# EAGLE design 15_MOV8 (EAGLE 7.5.0)
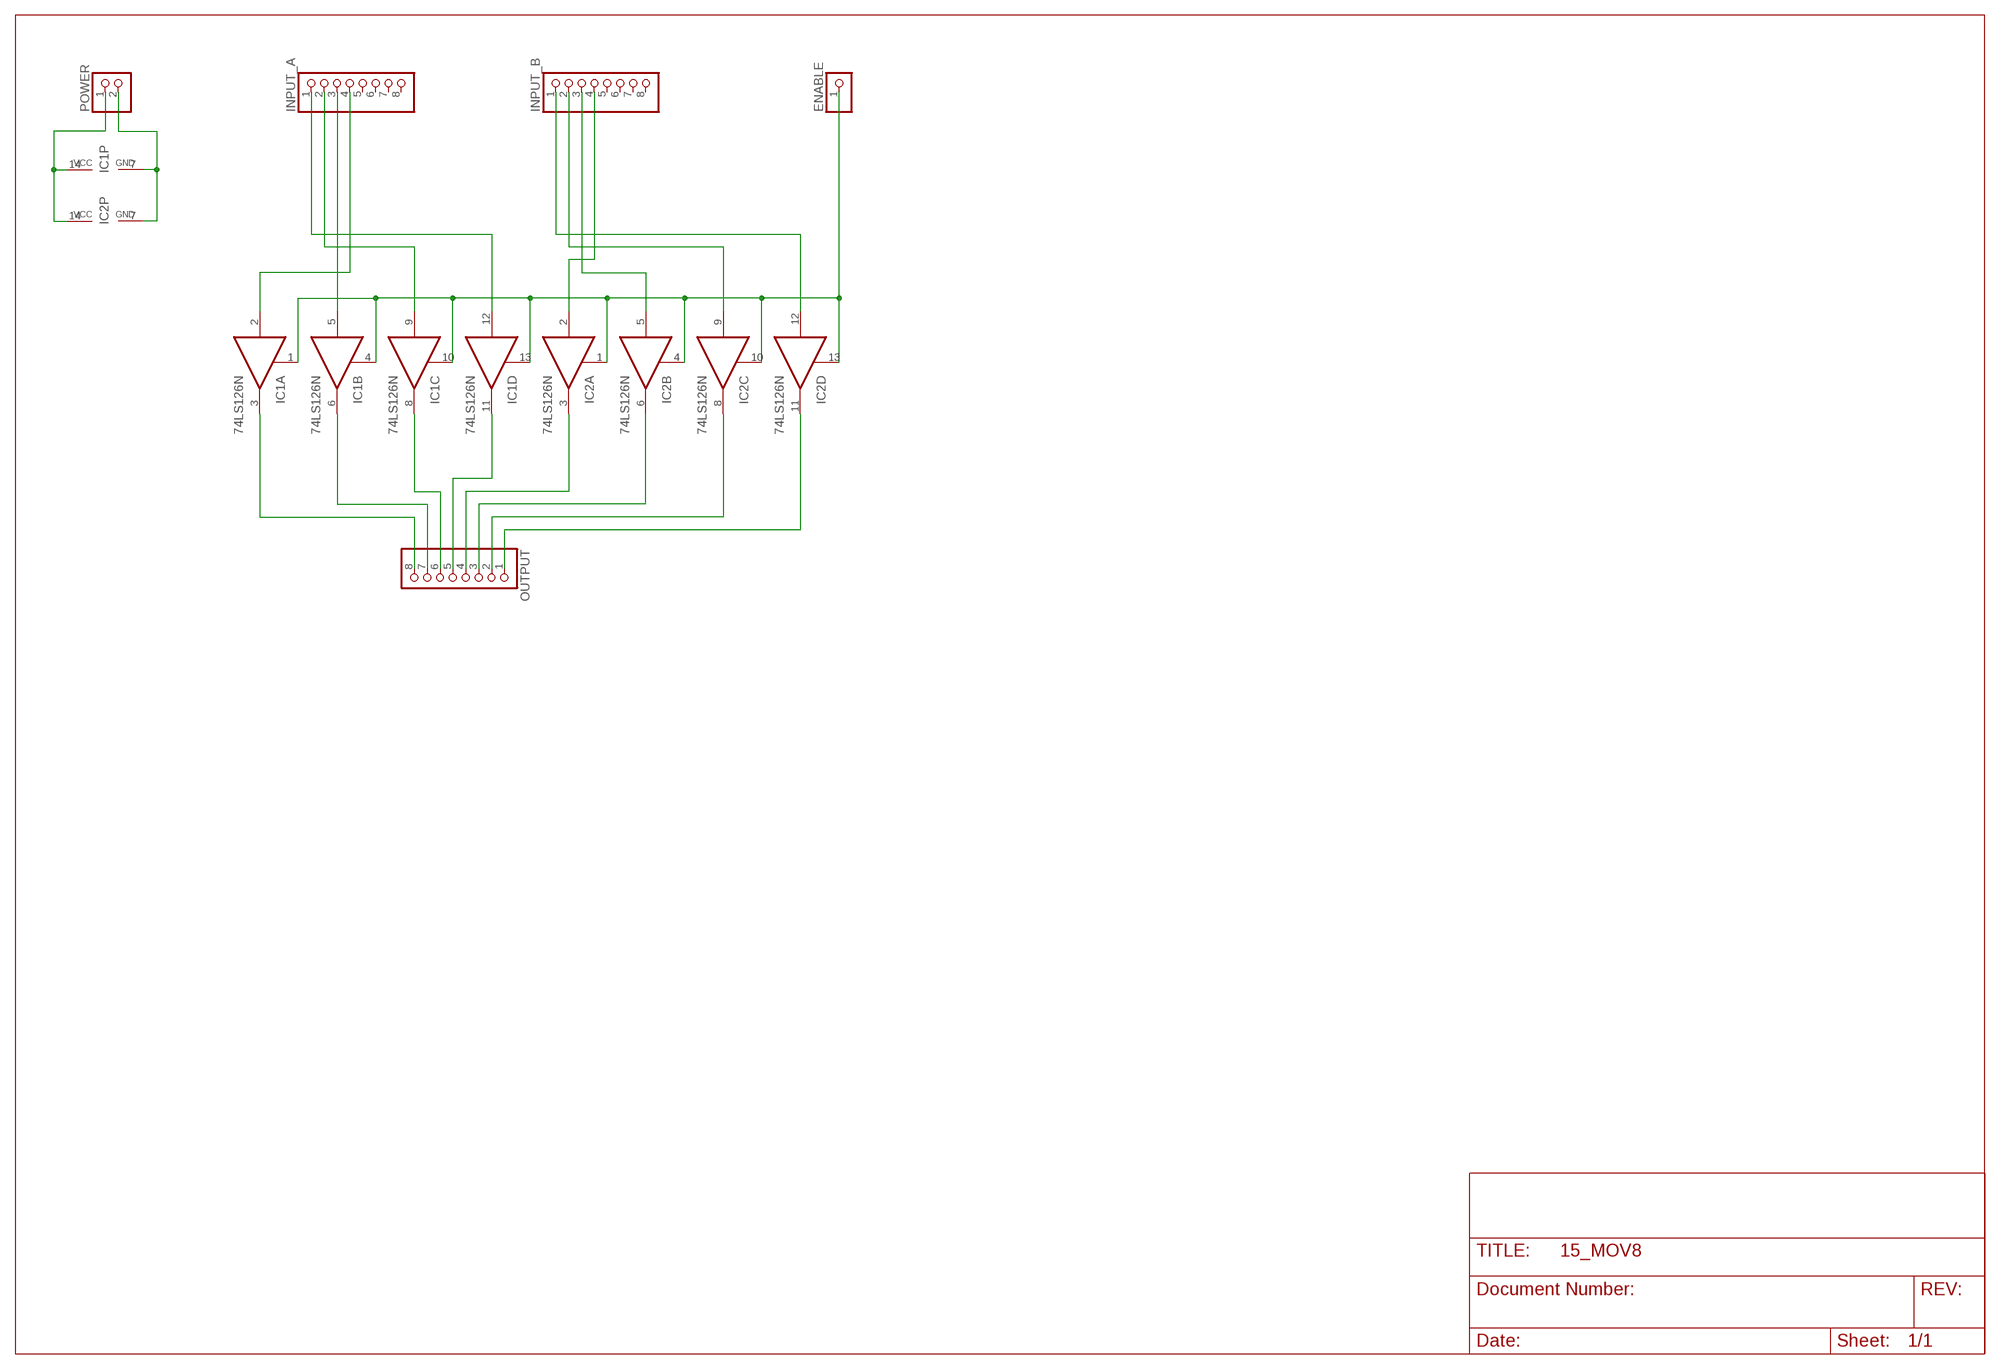
[diagram p0: schematic, sheet 1]

## Parts
ENABLE  PINHD-1X1  [1X01]
IC1  74LS126N  [DIL14]
IC2  74LS126N  [DIL14]
INPUT_A  PINHD-1X8  [1X08]
INPUT_B  PINHD-1X8  [1X08]
OUTPUT  PINHD-1X8  [1X08]
POWER  PINHD-1X2  [1X02]

## Nets
GND: IC1.7(P:GND) IC2.7(P:GND) POWER.2
N$1: IC1.3(A:O) OUTPUT.8
N$2: IC1.6(B:O) OUTPUT.7
N$3: IC1.8(C:O) OUTPUT.6
N$4: IC1.11(D:O) OUTPUT.5
N$5: IC2.3(A:O) OUTPUT.4
N$6: IC2.6(B:O) OUTPUT.3
N$7: IC2.8(C:O) OUTPUT.2
N$8: IC2.11(D:O) OUTPUT.1
N$9: IC1.12(D:I) INPUT_A.1
N$10: IC1.9(C:I) INPUT_A.2
N$11: IC1.5(B:I) INPUT_A.3
N$12: IC1.2(A:I) INPUT_A.4
N$13: IC2.12(D:I) INPUT_B.1
N$14: IC2.9(C:I) INPUT_B.2
N$15: IC2.5(B:I) INPUT_B.3
N$16: IC2.2(A:I) INPUT_B.4
N$17: ENABLE.1 IC1.1(A:OE) IC1.4(B:OE) IC1.10(C:OE) IC1.13(D:OE) IC2.1(A:OE) IC2.4(B:OE) IC2.10(C:OE) IC2.13(D:OE)
VCC: IC1.14(P:VCC) IC2.14(P:VCC) POWER.1
Unconnected: INPUT_A.5 INPUT_A.6 INPUT_A.7 INPUT_A.8 INPUT_B.5 INPUT_B.6 INPUT_B.7 INPUT_B.8

## Library data of the parts
ENABLE = pinhead:PINHD-1X1: PIN HEADER
IC1 IC2 = 74xx-eu:74*126: Quad bus BUFFER, 3-state
INPUT_A INPUT_B OUTPUT = pinhead:PINHD-1X8: PIN HEADER
POWER = pinhead:PINHD-1X2: PIN HEADER

## Board
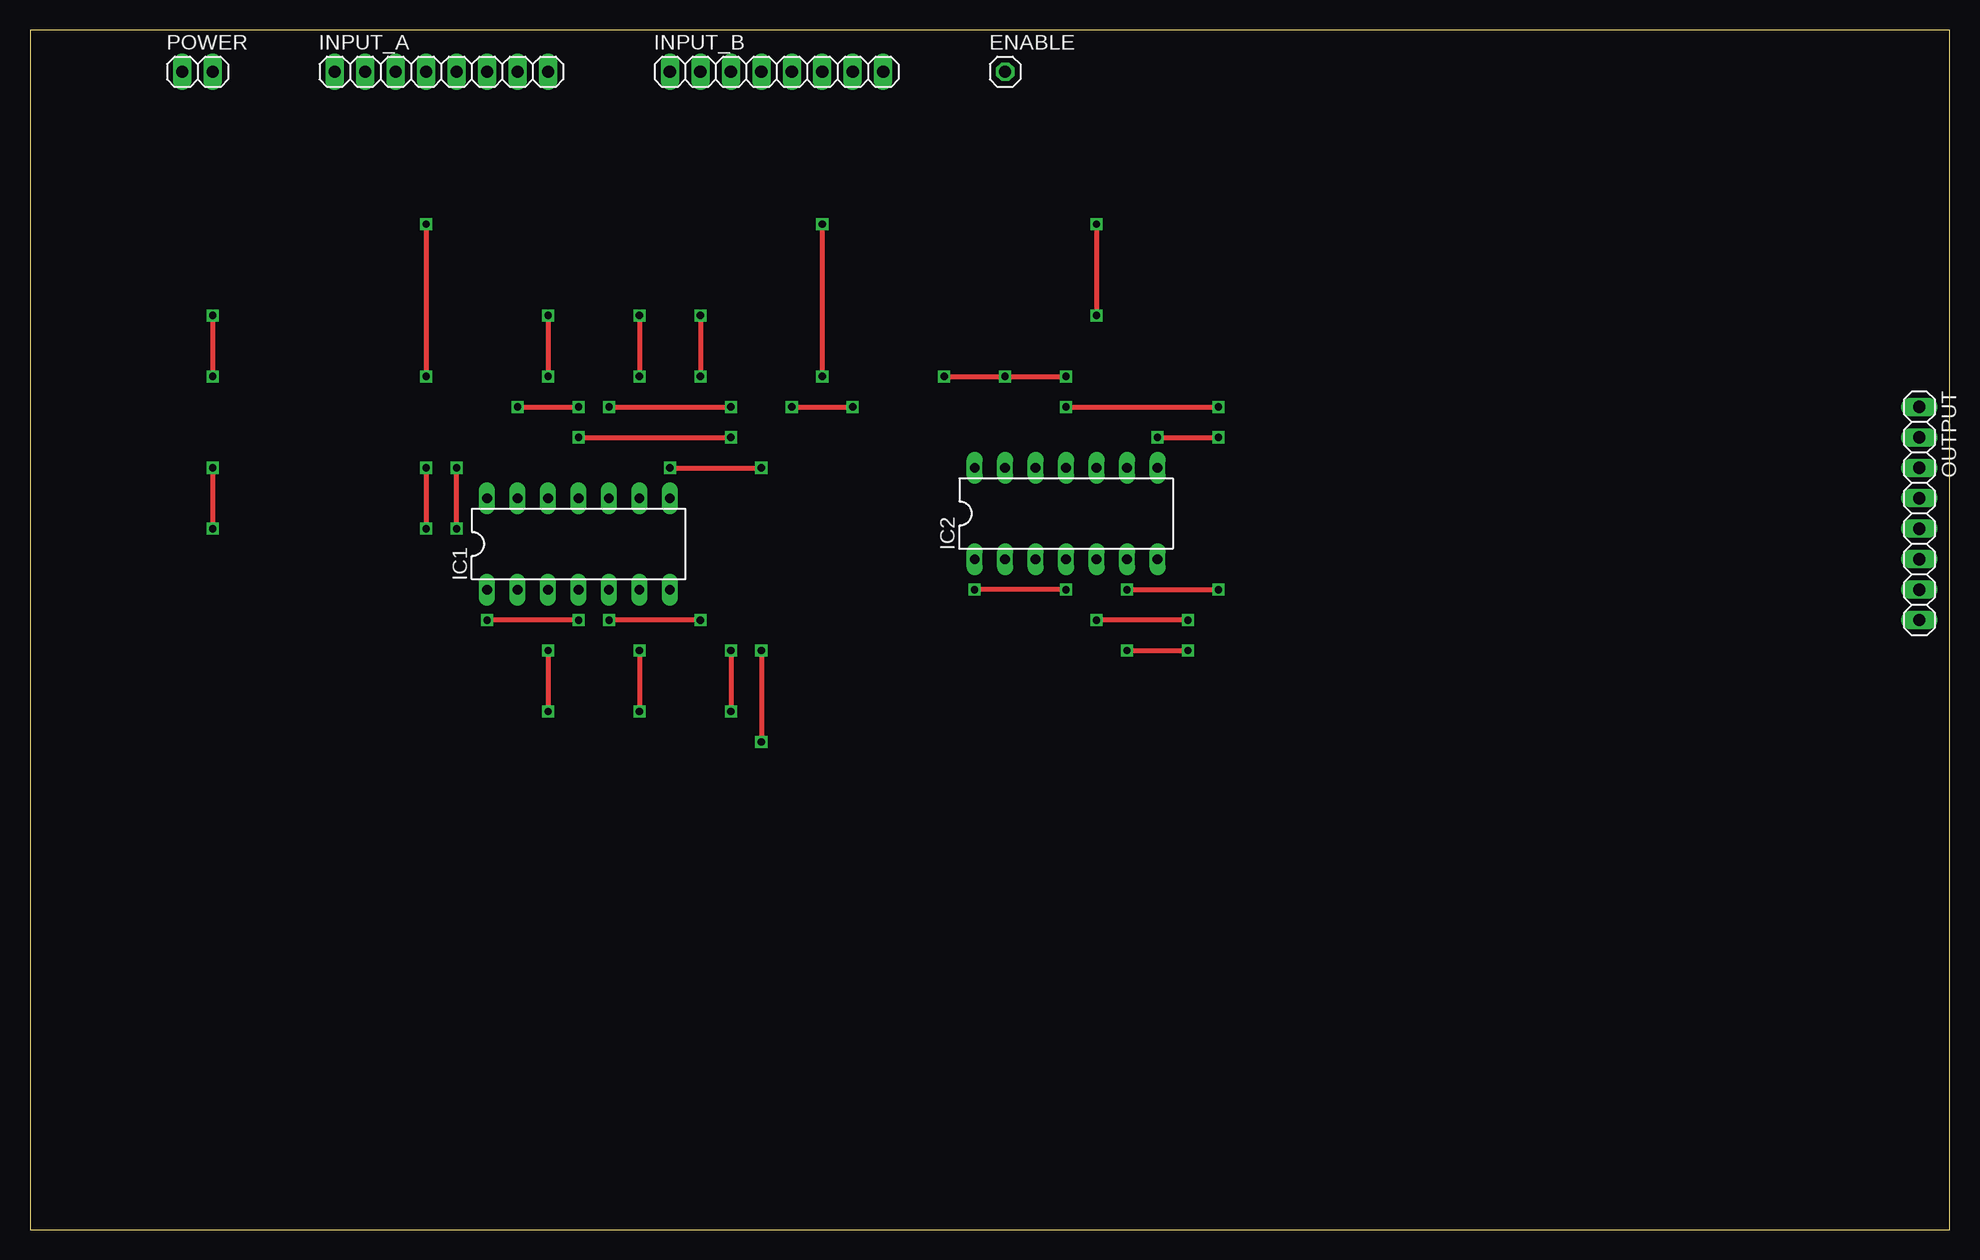
[diagram p1: board, top side]
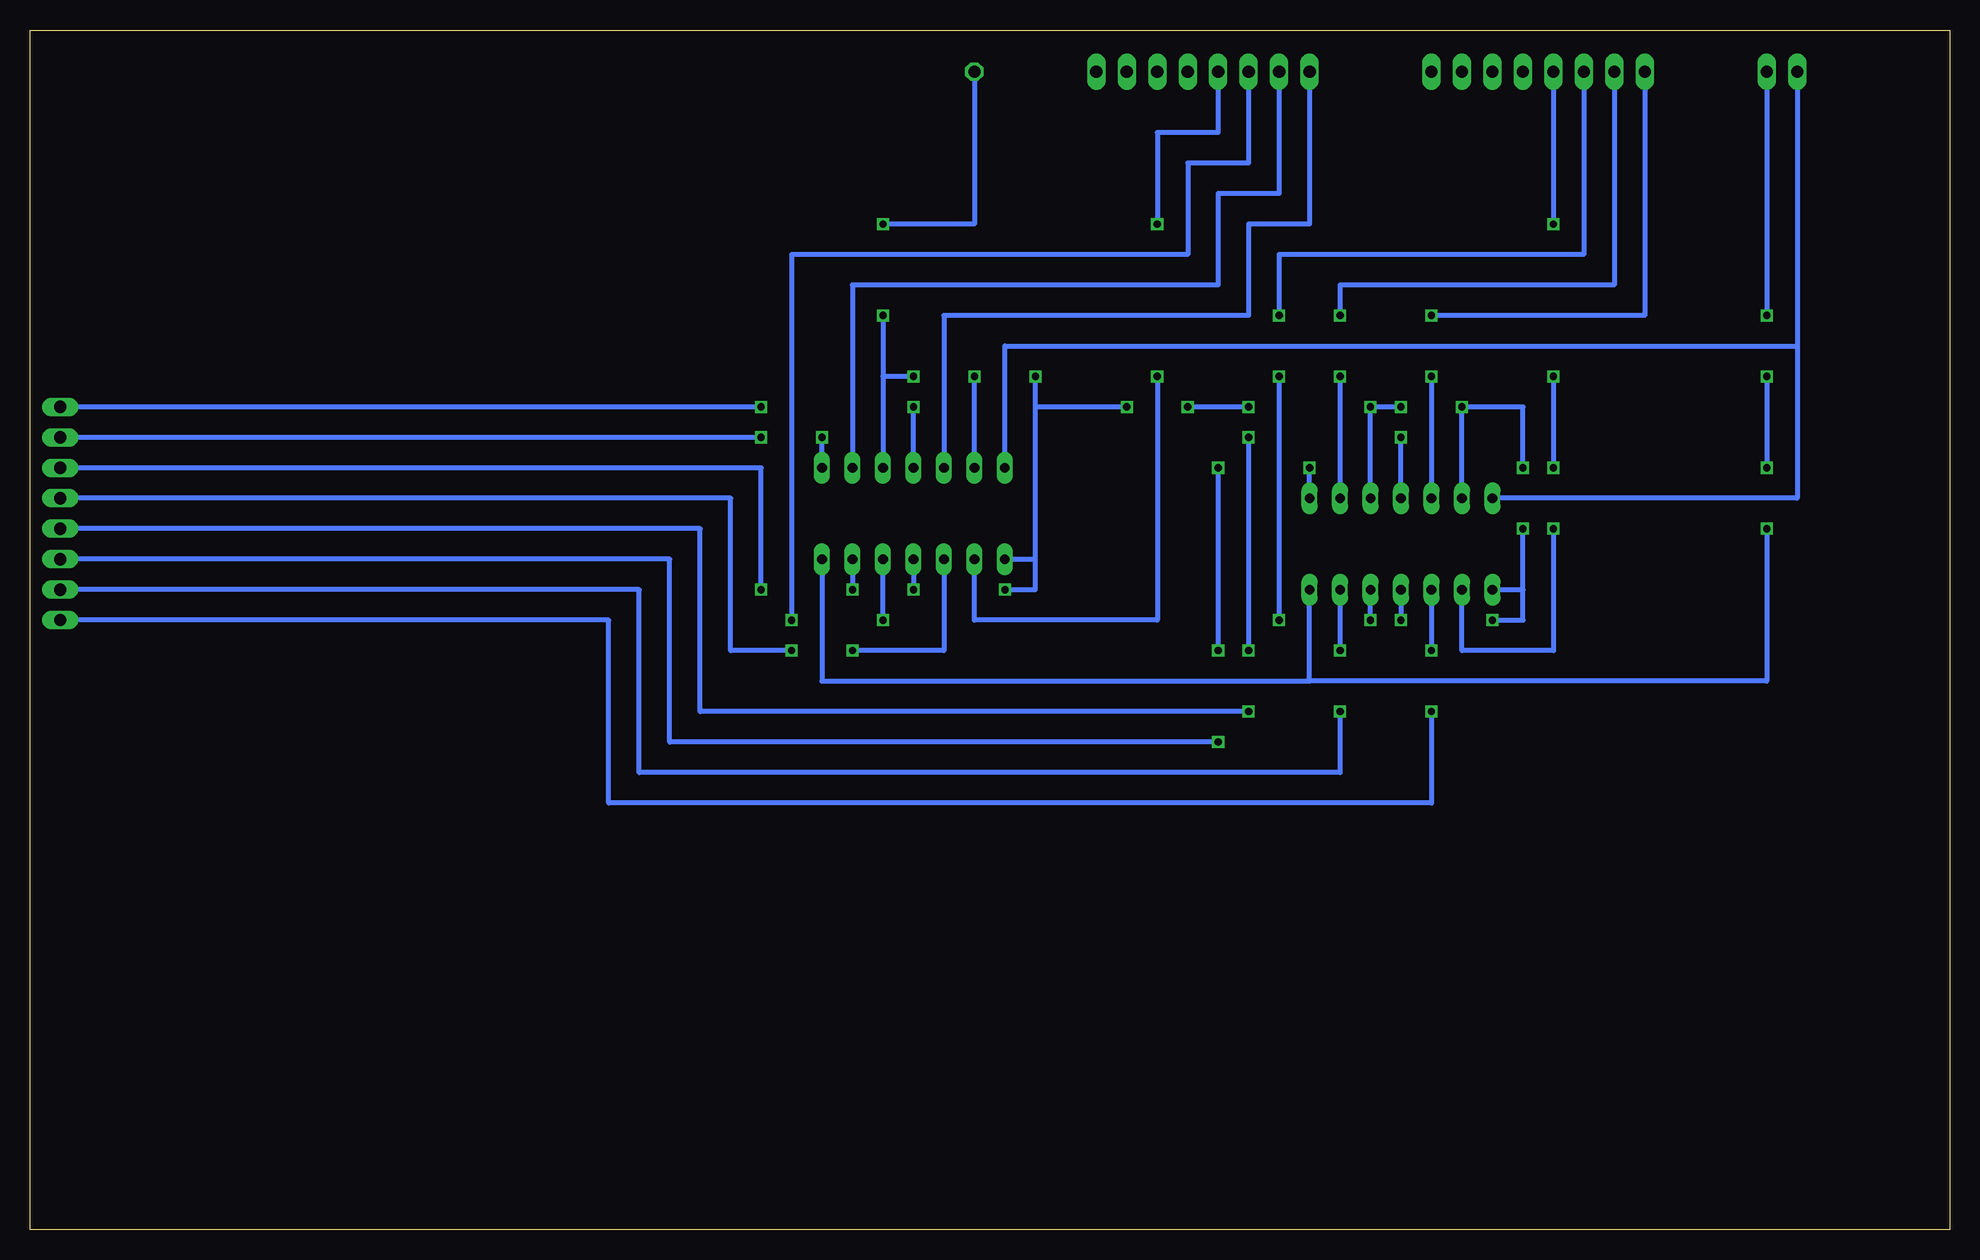
[diagram p2: board, bottom side, seen from below]

Size 160 x 100 mm. Coordinates in mm from the lower left corner, seen from the top.
Outline: 0,0 160,0 160,100 0,100 0,0
Copper layers (1*16): Top 0.035mm / dielectric 1.5mm / Bottom 0.035mm
Design rules "default": minimum track width 10mil, minimum drill 24mil, track to track 8mil, track to pad 8mil, pad to pad 8mil, via to via 8mil, smd to smd 8mil, copper to edge 40mil, drill to drill 8mil, minimum pad ring 10mil, minimum via ring 8mil, stop-mask expansion 4mil, vias tented up to drill 0mil, thermal gap 10mil

### Footprints (pad centres in the part's own frame; a part is rotated, then mirrored left to right if it is on the bottom)
1X01 = drill 1.016 octagon: 1 0,0
DIL14 = drill 0.813 long: 1 -7.62,-3.81; 2 -5.08,-3.81; 3 -2.54,-3.81; 4 0,-3.81; 5 2.54,-3.81; 6 5.08,-3.81; 7 7.62,-3.81; 8 7.62,3.81; 9 5.08,3.81; 10 2.54,3.81; 11 0,3.81; 12 -2.54,3.81; 13 -5.08,3.81; 14 -7.62,3.81
1X08 = drill 1.016 long: 1 -8.89,0; 2 -6.35,0; 3 -3.81,0; 4 -1.27,0; 5 1.27,0; 6 3.81,0; 7 6.35,0; 8 8.89,0
1X02 = drill 1.016 long: 1 -1.27,0; 2 1.27,0

### Placement (x,y rotation side)
ENABLE  81.28,96.52 0 top
IC1  45.72,57.15 0 top
IC2  86.36,59.69 0 top
INPUT_A  34.29,96.52 0 top
INPUT_B  62.23,96.52 0 top
OUTPUT  157.48,59.69 270 top
POWER  13.97,96.52 0 top

### Tracks (layer width: path | path; a pad name or v marks a point on that pad's centre or on a via)
GND  (via drill 0.6)
  Top 0.406: v15.24,76.2 v15.24,71.12 | v15.24,63.5 v15.24,58.42
  Bottom 0.406: POWER.2 v15.24,76.2 | v15.24,71.12 v15.24,63.5 | v15.24,58.42 15.24,45.72 53.34,45.72 | 53.34,45.72 IC1.7 | IC2.7 93.98,45.72 53.34,45.72
N$1  (via drill 0.6)
  Top 0.406: v43.18,48.26 v43.18,43.18
  Bottom 0.406: IC1.3 v43.18,48.26 | v43.18,43.18 43.18,35.56 111.76,35.56 111.76,50.8 OUTPUT.8
N$2  (via drill 0.6)
  Top 0.406: v50.8,48.26 v50.8,43.18
  Bottom 0.406: IC1.6 v50.8,48.26 | v50.8,43.18 50.8,38.1 109.22,38.1 109.22,53.34 OUTPUT.7
N$3  (via drill 0.6)
  Top 0.406: v53.34,63.5 v60.96,63.5 | v60.96,48.26 v60.96,40.64
  Bottom 0.406: IC1.8 v53.34,63.5 | v60.96,63.5 v60.96,48.26 | v60.96,40.64 106.68,40.64 106.68,55.88 OUTPUT.6
N$4  (via drill 0.6)
  Top 0.406: v45.72,66.04 v58.42,66.04 | v58.42,48.26 v58.42,43.18
  Bottom 0.406: IC1.11 v45.72,66.04 | v58.42,66.04 v58.42,48.26 | v58.42,43.18 104.14,43.18 104.14,58.42 OUTPUT.5
N$5  (via drill 0.6)
  Top 0.406: v91.44,48.26 v96.52,48.26
  Bottom 0.406: IC2.3 83.82,48.26 v91.44,48.26 | v96.52,48.26 101.6,48.26 101.6,60.96 OUTPUT.4
N$6  (via drill 0.6)
  Top 0.406: v91.44,53.34 v99.06,53.34
  Bottom 0.406: IC2.6 v91.44,53.34 | v99.06,53.34 99.06,63.5 OUTPUT.3
N$7  (via drill 0.6)
  Top 0.406: v93.98,66.04 v99.06,66.04
  Bottom 0.406: IC2.8 v93.98,66.04 | v99.06,66.04 OUTPUT.2
N$8  (via drill 0.6)
  Top 0.406: v86.36,68.58 v99.06,68.58
  Bottom 0.406: IC2.11 v86.36,68.58 | v99.06,68.58 OUTPUT.1
N$9  (via drill 0.6)
  Top 0.406: v43.18,76.2 v43.18,71.12
  Bottom 0.406: INPUT_A.1 25.4,76.2 v43.18,76.2 | v43.18,71.12 IC1.12
N$10  (via drill 0.6)
  Top 0.406: v50.8,76.2 v50.8,71.12
  Bottom 0.406: INPUT_A.2 27.94,78.74 50.8,78.74 v50.8,76.2 | v50.8,71.12 IC1.9
N$11  (via drill 0.6)
  Top 0.406: v55.88,76.2 v55.88,71.12 | v55.88,50.8 v48.26,50.8
  Bottom 0.406: INPUT_A.3 30.48,81.28 55.88,81.28 v55.88,76.2 | v55.88,71.12 v55.88,50.8 | v48.26,50.8 IC1.5
N$12  (via drill 0.6)
  Top 0.406: v33.02,83.82 v33.02,71.12 | v33.02,63.5 v33.02,58.42
  Bottom 0.406: INPUT_A.4 v33.02,83.82 | v33.02,71.12 v33.02,63.5 | v33.02,58.42 33.02,48.26 40.64,48.26 IC1.2
N$13
  Bottom 0.406: INPUT_B.1 53.34,83.82 58.42,83.82 58.42,76.2 83.82,76.2 IC2.12
N$14
  Bottom 0.406: INPUT_B.2 55.88,86.36 60.96,86.36 60.96,78.74 91.44,78.74 IC2.9
N$15  (via drill 0.6)
  Top 0.406: v96.52,50.8 v88.9,50.8
  Bottom 0.406: INPUT_B.3 58.42,88.9 63.5,88.9 63.5,81.28 96.52,81.28 v96.52,50.8 | v88.9,50.8 IC2.5
N$16  (via drill 0.6)
  Top 0.406: v66.04,83.82 v66.04,71.12
  Bottom 0.406: INPUT_B.4 60.96,91.44 66.04,91.44 v66.04,83.82 | v66.04,71.12 66.04,50.8 81.28,50.8 IC2.2
N$17  (via drill 0.6)
  Top 0.406: v88.9,83.82 v88.9,76.2 | v86.36,71.12 v81.28,71.12 v76.2,71.12 | v48.26,68.58 v58.42,68.58 | v63.5,68.58 v68.58,68.58 | v40.64,68.58 v45.72,68.58 | v35.56,58.42 v35.56,63.5 | v45.72,50.8 v38.1,50.8 | v86.36,53.34 v78.74,53.34
  Bottom 0.406: ENABLE.1 81.28,83.82 v88.9,83.82 | v88.9,76.2 88.9,71.12 | 88.9,71.12 IC2.10 | IC2.13 v81.28,71.12 | v86.36,71.12 88.9,71.12 | IC1.10 v48.26,68.58 v45.72,68.58 | v58.42,68.58 v63.5,68.58 | v68.58,68.58 76.2,68.58 | 76.2,68.58 v76.2,71.12 | IC1.13 v40.64,68.58 35.56,68.58 v35.56,63.5 | IC1.1 35.56,53.34 | 35.56,53.34 v35.56,58.42 | IC1.4 v45.72,50.8 | v38.1,50.8 35.56,50.8 35.56,53.34 | IC2.1 76.2,55.88 | 76.2,55.88 76.2,68.58 | IC2.4 v86.36,53.34 | v78.74,53.34 76.2,53.34 76.2,55.88
VCC
  Bottom 0.406: POWER.1 12.7,73.66 | 12.7,73.66 12.7,60.96 IC1.14 | IC2.14 78.74,73.66 12.7,73.66